# EAGLE schematic laserpcbpower (EAGLE 5.11)
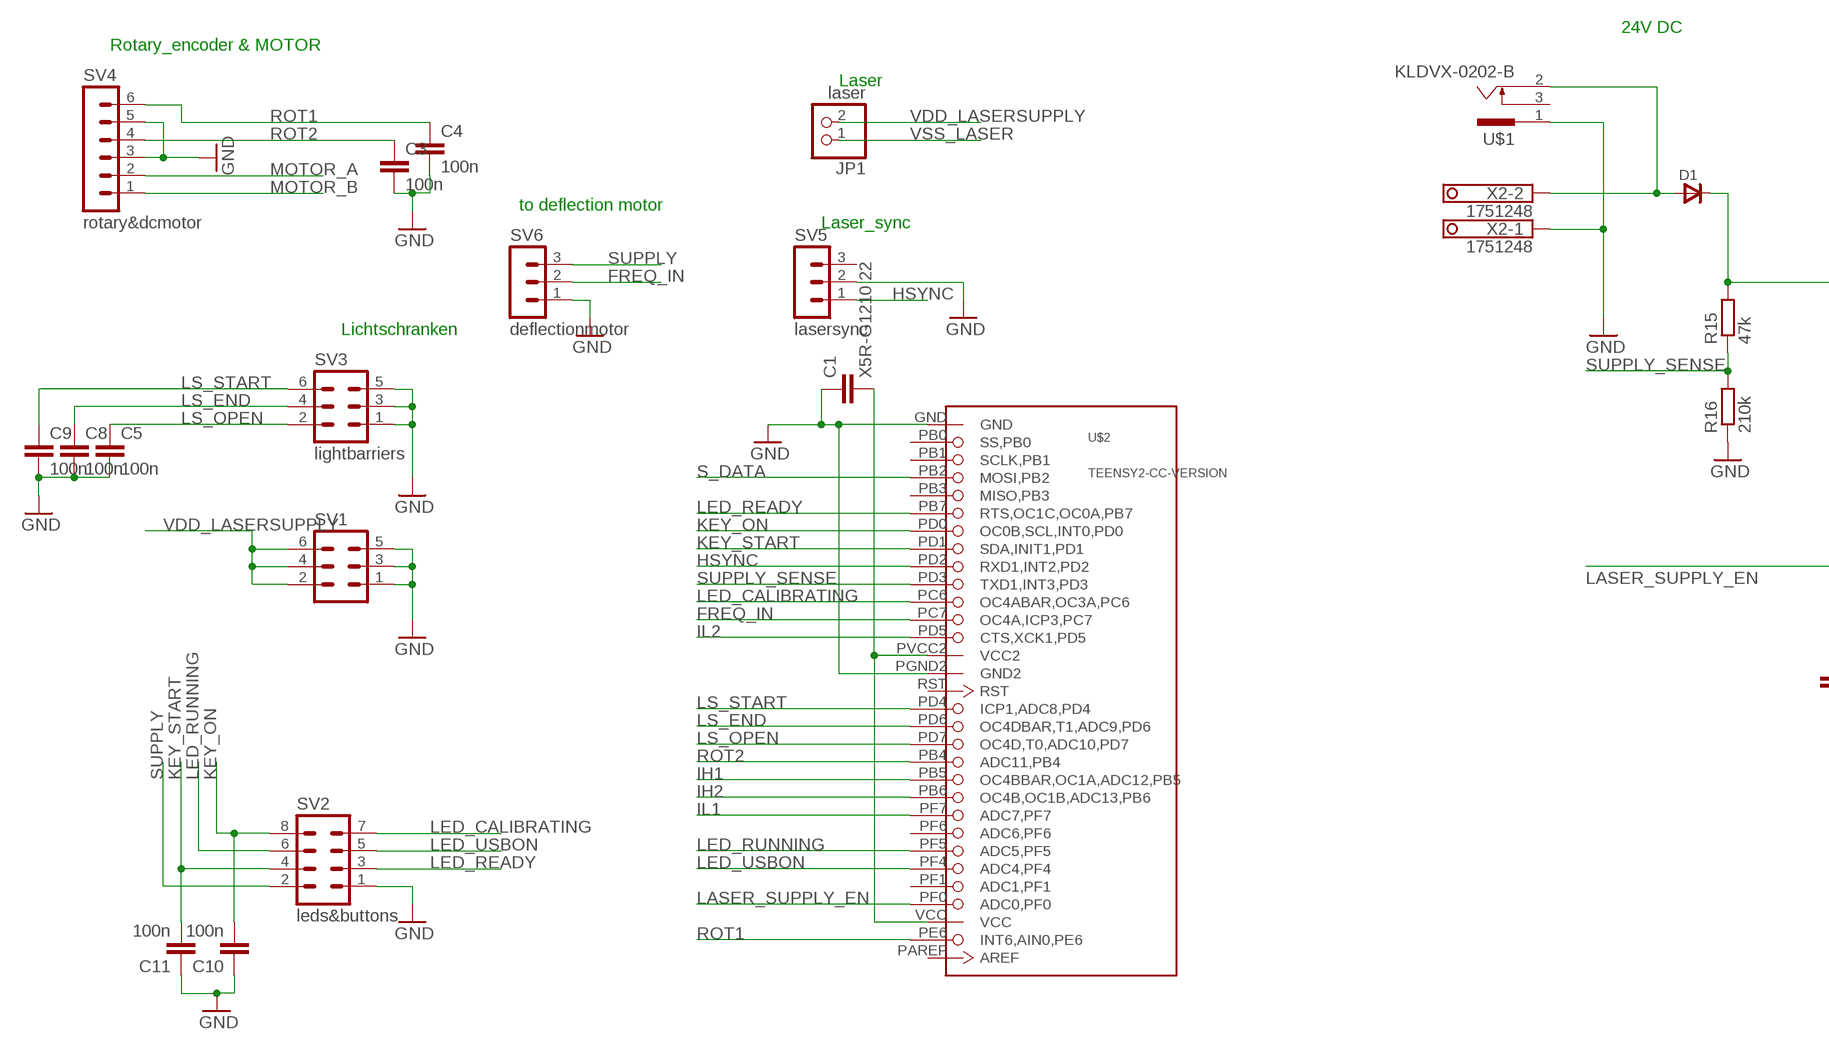
[diagram p0: schematic, sheet 1, part 1 of 2]
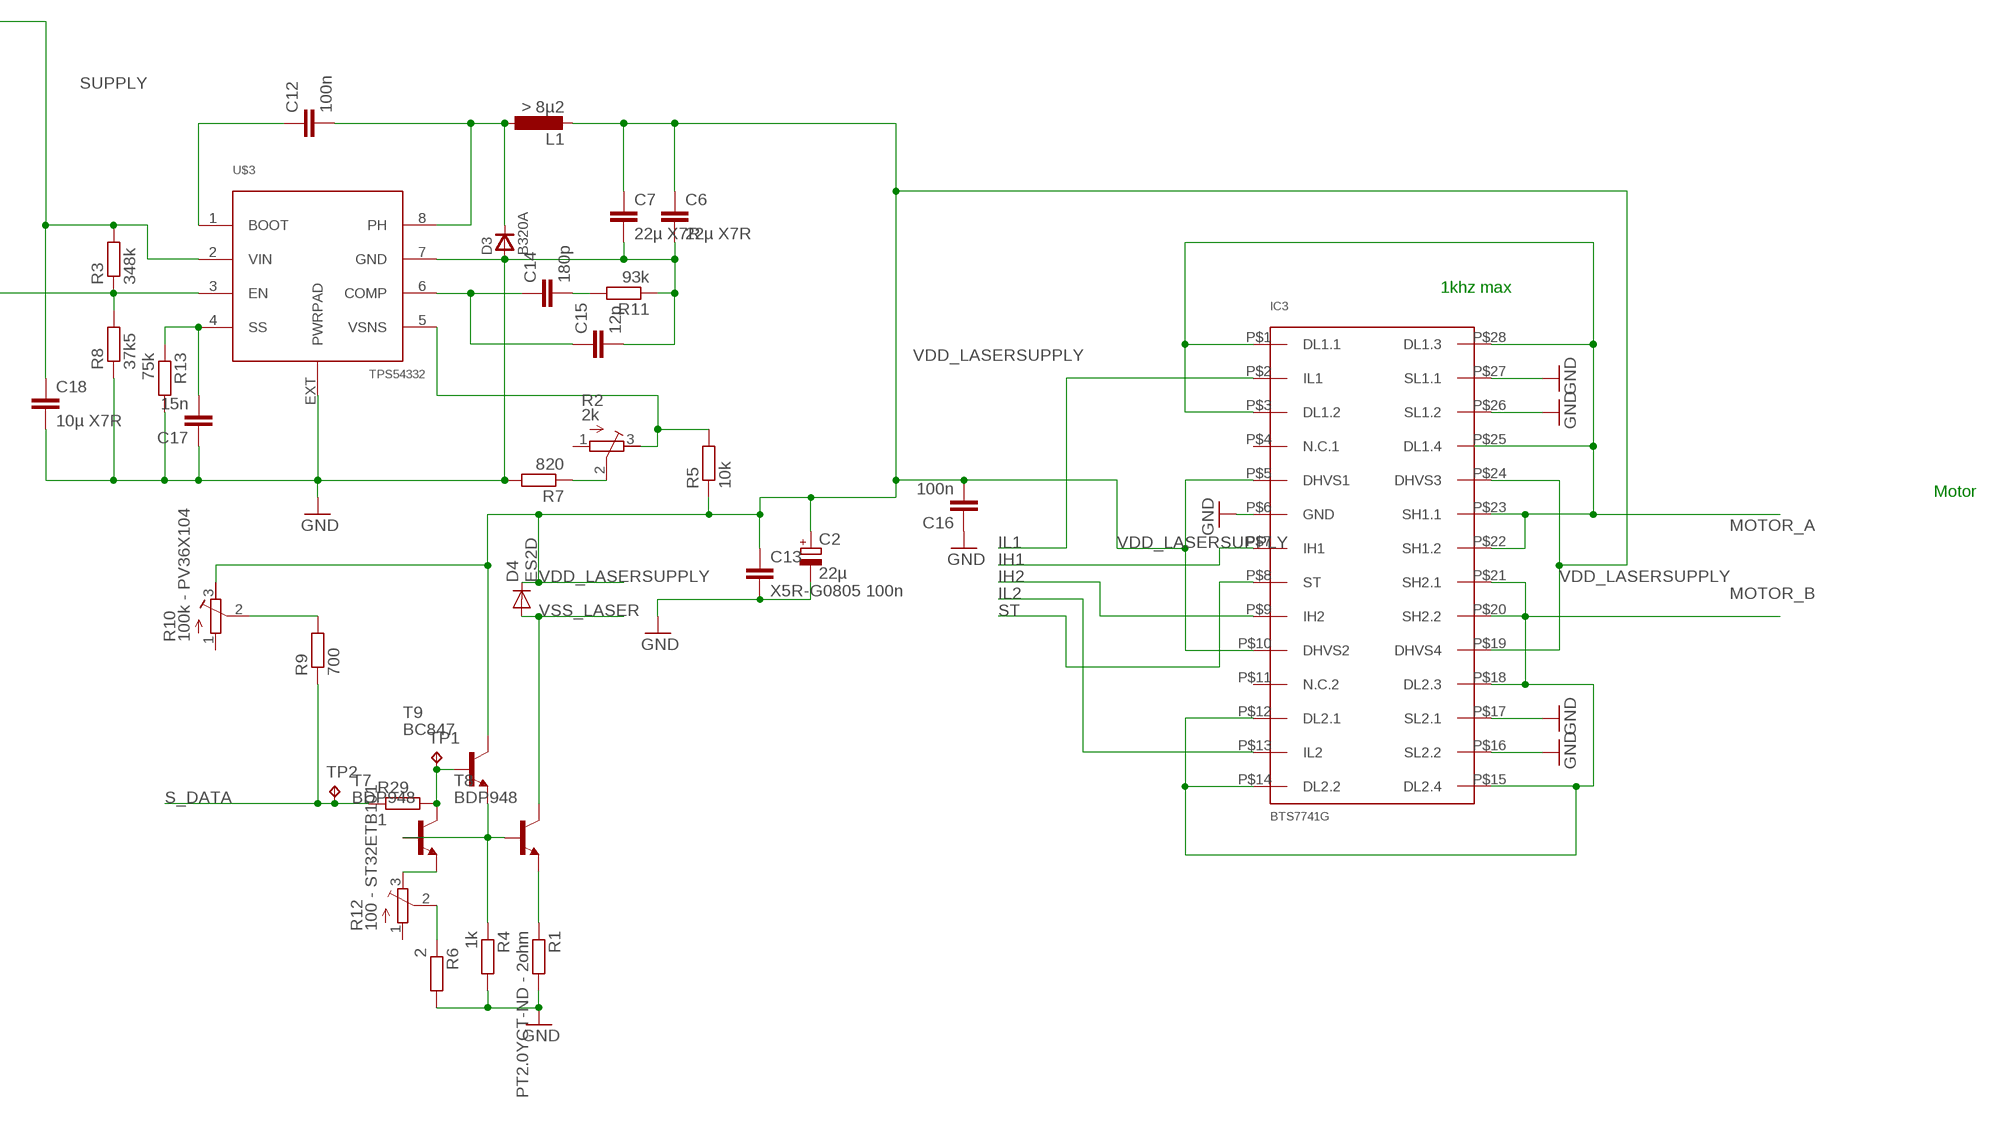
[diagram p1: schematic, sheet 1, part 2 of 2]

## Parts
C1  X5R-G1210 22  C-EUC1210  [C1210]
C2  22µ  CPOL-EUD  [PANASONIC_D]
C3  100n  C-EUC0805  [C0805]
C4  100n  C-EUC0805  [C0805]
C5  100n  C-EUC0805  [C0805]
C6  22µ X7R  C-EUC1210  [C1210]
C7  22µ X7R  C-EUC1210  [C1210]
C8  100n  C-EUC0805  [C0805]
C9  100n  C-EUC0805  [C0805]
C10  100n  C-EUC0805  [C0805]
C11  100n  C-EUC0805  [C0805]
C12  100n  C-EUC0805  [C0805]
C13  X5R-G0805 100n  C-EUC0805  [C0805]
C14  180p  C-EUC0805  [C0805]
C15  12p  C-EUC0805  [C0805]
C16  100n  C-EUC0805  [C0805]
C17  15n  C-EUC0805  [C0805]
C18  10µ X7R  C-EUC1210  [C1210]
D1  DSMA  [DSMA]
D3  B320A  DSMA  [DSMA]
D4  ES2D  DIODE-SOD323-R  [SOD323-R]
IC3  BTS7741G  [P-DSO-28-14]
JP1  laser  PINHD-1X2  [1X02]
L1  > 8µ2  L-EUPIS28XX  [PIS28XX]
R1  PT2.0YCT-ND - 2ohm  R-EU_VMTB60  [VMTB60]
R2  2k  R-TRIMM64X  [RTRIM64X]
R3  348k  R-EU_M0805  [M0805]
R4  1k  R-EU_M0805  [M0805]
R5  10k  R-EU_M0805  [M0805]
R6  2  R-EU_M0805  [M0805]
R7  820  R-EU_M0805  [M0805]
R8  37k5  R-EU_M0805  [M0805]
R9  700  R-EU_M0805  [M0805]
R10  100k - PV36X104  R-TRIMM64X  [RTRIM64X]
R11  93k  R-EU_M0805  [M0805]
R12  100 - ST32ETB101  TRIM_EU-SM-42/43A  [SM-42/43A]
R13  75k  R-EU_M0805  [M0805]
R15  47k  R-EU_M0805  [M0805]
R16  210k  R-EU_M0805  [M0805]
R29  1  R-EU_R0805  [R0805]
SV1  MA03-2  [MA03-2]
SV2  leds&buttons  MA04-2  [MA04-2]
SV3  lightbarriers  MA03-2  [MA03-2]
SV4  rotary&dcmotor  MA06-1  [MA06-1]
SV5  lasersync  MA03-1  [MA03-1]
SV6  deflectionmotor  MA03-1  [MA03-1]
T7  BDP948  BC868-NPN-SOT89-BCE  [SOT89-BCE]
T8  BDP948  BC868-NPN-SOT89-BCE  [SOT89-BCE]
T9  BC847  [SOT23]
TP1  TPB1,27  [B1,27]
TP2  TPB1,27  [B1,27]
U$1  KLDVX-0202-B  [KLDVX-0202-B]
U$2  TEENSY2-CC-VERSION  [TEENSY2]
U$3  TPS54332  [SO8-COOL]
X2  1751248  [1751248]

## Nets
FREQ_IN: SV6.2 U$2.PC7(OC4A,ICP3,PC7)
GND: C1.1 C2.- C3.2 C4.2 C5.2 C6.2 C7.2 C8.2 C9.2 C10.1 C11.1 C13.2 C15.2 C16.1 C17.1 C18.2 D3.A IC3.P$6(GND) IC3.P$16(SL2.2) IC3.P$17(SL2.1) IC3.P$26(SL1.2) IC3.P$27(SL1.1) R1.2 R4.2 R6.2 R7.2 R8.1 R11.1 R13.2 R16.1 SV1.1 SV1.3 SV1.5 SV2.1 SV3.1 SV3.3 SV3.5 SV4.3 SV4.5 SV5.2 SV6.1 U$1.1 U$2.GND U$2.PGND2(GND2) U$3.7(GND) U$3.EXT(PWRPAD) X2.1
HSYNC: SV5.1 U$2.PD2(RXD1,INT2,PD2)
IH1: IC3.P$7(IH1) U$2.PB5(OC4BBAR,OC1A,ADC12,PB5)
IH2: IC3.P$9(IH2) U$2.PB6(OC4B,OC1B,ADC13,PB6)
IL1: IC3.P$2(IL1) U$2.PF7(ADC7,PF7)
IL2: IC3.P$13(IL2) U$2.PD5(CTS,XCK1,PD5)
KEY_ON: C10.2 SV2.8 U$2.PD0(OC0B,SCL,INT0,PD0)
KEY_START: C11.2 SV2.4 U$2.PD1(SDA,INIT1,PD1)
LASER_SUPPLY_EN: R3.1 R8.2 U$2.PF0(ADC0,PF0) U$3.3(EN)
LED_CALIBRATING: SV2.7 U$2.PC6(OC4ABAR,OC3A,PC6)
LED_READY: SV2.3 U$2.PB7(RTS,OC1C,OC0A,PB7)
LED_RUNNING: SV2.6 U$2.PF5(ADC5,PF5)
LED_USBON: SV2.5 U$2.PF4(ADC4,PF4)
LS_END: C8.1 SV3.4 U$2.PD6(OC4DBAR,T1,ADC9,PD6)
LS_OPEN: C5.1 SV3.2 U$2.PD7(OC4D,T0,ADC10,PD7)
LS_START: C9.1 SV3.6 U$2.PD4(ICP1,ADC8,PD4)
MOTOR_A: IC3.P$1(DL1.1) IC3.P$3(DL1.2) IC3.P$22(SH1.2) IC3.P$23(SH1.1) IC3.P$28(DL1.3) SV4.2
MOTOR_B: IC3.P$12(DL2.1) IC3.P$14(DL2.2) IC3.P$15(DL2.4) IC3.P$18(DL2.3) IC3.P$20(SH2.2) IC3.P$21(SH2.1) SV4.1
N$1: R1.1 T8.E
N$2: R2.2(S) R7.1
N$4: C14.1 C15.1 U$3.6(COMP)
N$5: C14.2 R11.2
N$6: D1.A U$1.2 X2.2
N$7: C12.1 U$3.1(BOOT)
N$8: C12.2 D3.C L1.2 U$3.8(PH)
N$9: R2.3(A) R5.2 U$3.5(VSNS)
N$10: R4.1 T7.B T8.B T9.2(E)
N$13: C17.2 R13.1 U$3.4(SS)
N$16: R9.2 R10.2(S)
N$18: R12.3(E) T7.E
N$22: R6.1 R12.2(S)
N$36: C1.2 U$2.PVCC2(VCC2) U$2.VCC
N$46: R29.2 T7.C T9.1(B) TP1.TP
ROT1: C4.1 SV4.6 U$2.PE6(INT6,AIN0,PE6)
ROT2: C3.1 SV4.4 U$2.PB4(ADC11,PB4)
S_DATA: R9.1 R29.1 TP2.TP U$2.PB2(MOSI,PB2)
ST: IC3.P$8(ST)
SUPPLY: C18.1 D1.C R3.2 R15.2 SV2.2 SV6.3 U$3.2(VIN)
SUPPLY_SENSE: R15.1 R16.2 U$2.PD3(TXD1,INT3,PD3)
VDD_LASERSUPPLY: C2.+ C6.1 C7.1 C13.1 C16.2 D4.C IC3.P$5(DHVS1) IC3.P$10(DHVS2) IC3.P$19(DHVS4) IC3.P$24(DHVS3) JP1.2 L1.1 R5.1 R10.3(A) SV1.2 SV1.4 SV1.6 T9.3(C)
VSS_LASER: D4.A JP1.1 T8.C
Unconnected: IC3.P$4(N.C.1) IC3.P$11(N.C.2) IC3.P$25(DL1.4) R2.1(E) R10.1(E) R12.1(A) SV5.3 U$1.1@1 U$1.2@1 U$1.3 U$1.3@1 U$2.PAREF(AREF) U$2.PB0(SS,PB0) U$2.PB1(SCLK,PB1) U$2.PB3(MISO,PB3) U$2.PF1(ADC1,PF1) U$2.PF6(ADC6,PF6) U$2.RST

## Notes on the sheet
- 24V DC
- Rotary_encoder & MOTOR
- Laser
- to deflection motor
- Laser_sync
- Lichtschranken
- 1khz max
- Motor

## Library data of the parts
C1 C3-C18 = rcl:C-EU: CAPACITOR, European symbol
C2 = rcl:CPOL-EU: POLARIZED CAPACITOR, European symbol
D1 D3 = diodes:D: Diode
D4 = diode:DIODE-: DIODE
IC3 = Labor:BTS7741G: H-Bridge DC Motor driver Quad D-MOS switch driver Free configurable as bridge or quad-switch Optimized for DC motor management applications Low RDS ON: 110 m? high-side switch, 100 m? low-side switch (typical values @ 25 °C) Maximum peak current: typ. 10 A @ 25 °C Very low quiescent current: typ. 5 ?A @ 25 °C Small outline, enhanced power P-DSO-package Full short-circuit-protection Operates up to 40 V Status flag diagnosis Overtemperature shut down with hysteresis Internal clamp diodes Open load detection in Off-mode Under-voltage detection with hysteresis PWM frequencies up to 1 kHz
JP1 = pinhead:PINHD-1X2: PIN HEADER
L1 = Inductor-Fastron:L-EU
R1 R3 R5-R8 R11 R13 R15 R16 R29 = rcl:R-EU_: RESISTOR, European symbol
R2 R10 = rcl:R-TRIMM: Trimm resistor
R4 R9 = resistor:R-EU_: RESISTOR, European symbol
R12 = pot:TRIM_EU-: POTENTIOMETER
SV1 SV3 = con-lstb:MA03-2: PIN HEADER; OC_FARNELL: unknown; OC_NEWARK: unknown
SV2 = con-lstb:MA04-2: PIN HEADER; OC_FARNELL: unknown; OC_NEWARK: unknown
SV4 = con-lstb:MA06-1: PIN HEADER; OC_FARNELL: unknown; OC_NEWARK: unknown
SV5 SV6 = con-lstb:MA03-1: PIN HEADER; OC_FARNELL: unknown; OC_NEWARK: unknown
T7 T8 = transistor:*-NPN-: NPN Transistror BF959 corrected 2008.03.06
T9 = transistor:BC847: NPN TRANSISTOR
TP1 TP2 = testpad:TP: Test pad
U$1 = con-kycon:KLDVX-0202-: Power Jack, Vertical, PCB Mount, 2.0 mm, 2.5 mm, 3.0 mm Center Pin Source: KLDVX-0202x.pdf; OC_FARNELL: unknown; OC_NEWARK: unknown
U$2 = teensy2:TEENSY2-C
U$3 = Labor:TPS54332
X2 = con-phoenix-350:1751248: MKDS 1/ 2-3,5 Printklemme Nennstrom: 10 A Bemessungsspannung: 160 V Raster: 3,5 mm Polzahl: 2 Montageart: Löten Anschlussart: Schraubanschluss Anschlussrichtung vom Leiter zur Platine: 0° Source: http://eshop.phoenixcontact.com .. 1751248.pdf; OC_FARNELL: unknown; OC_NEWARK: unknown